# EAGLE design Smart_Powermeter (EAGLE 9.5.1)

## Sheet 1 of 2
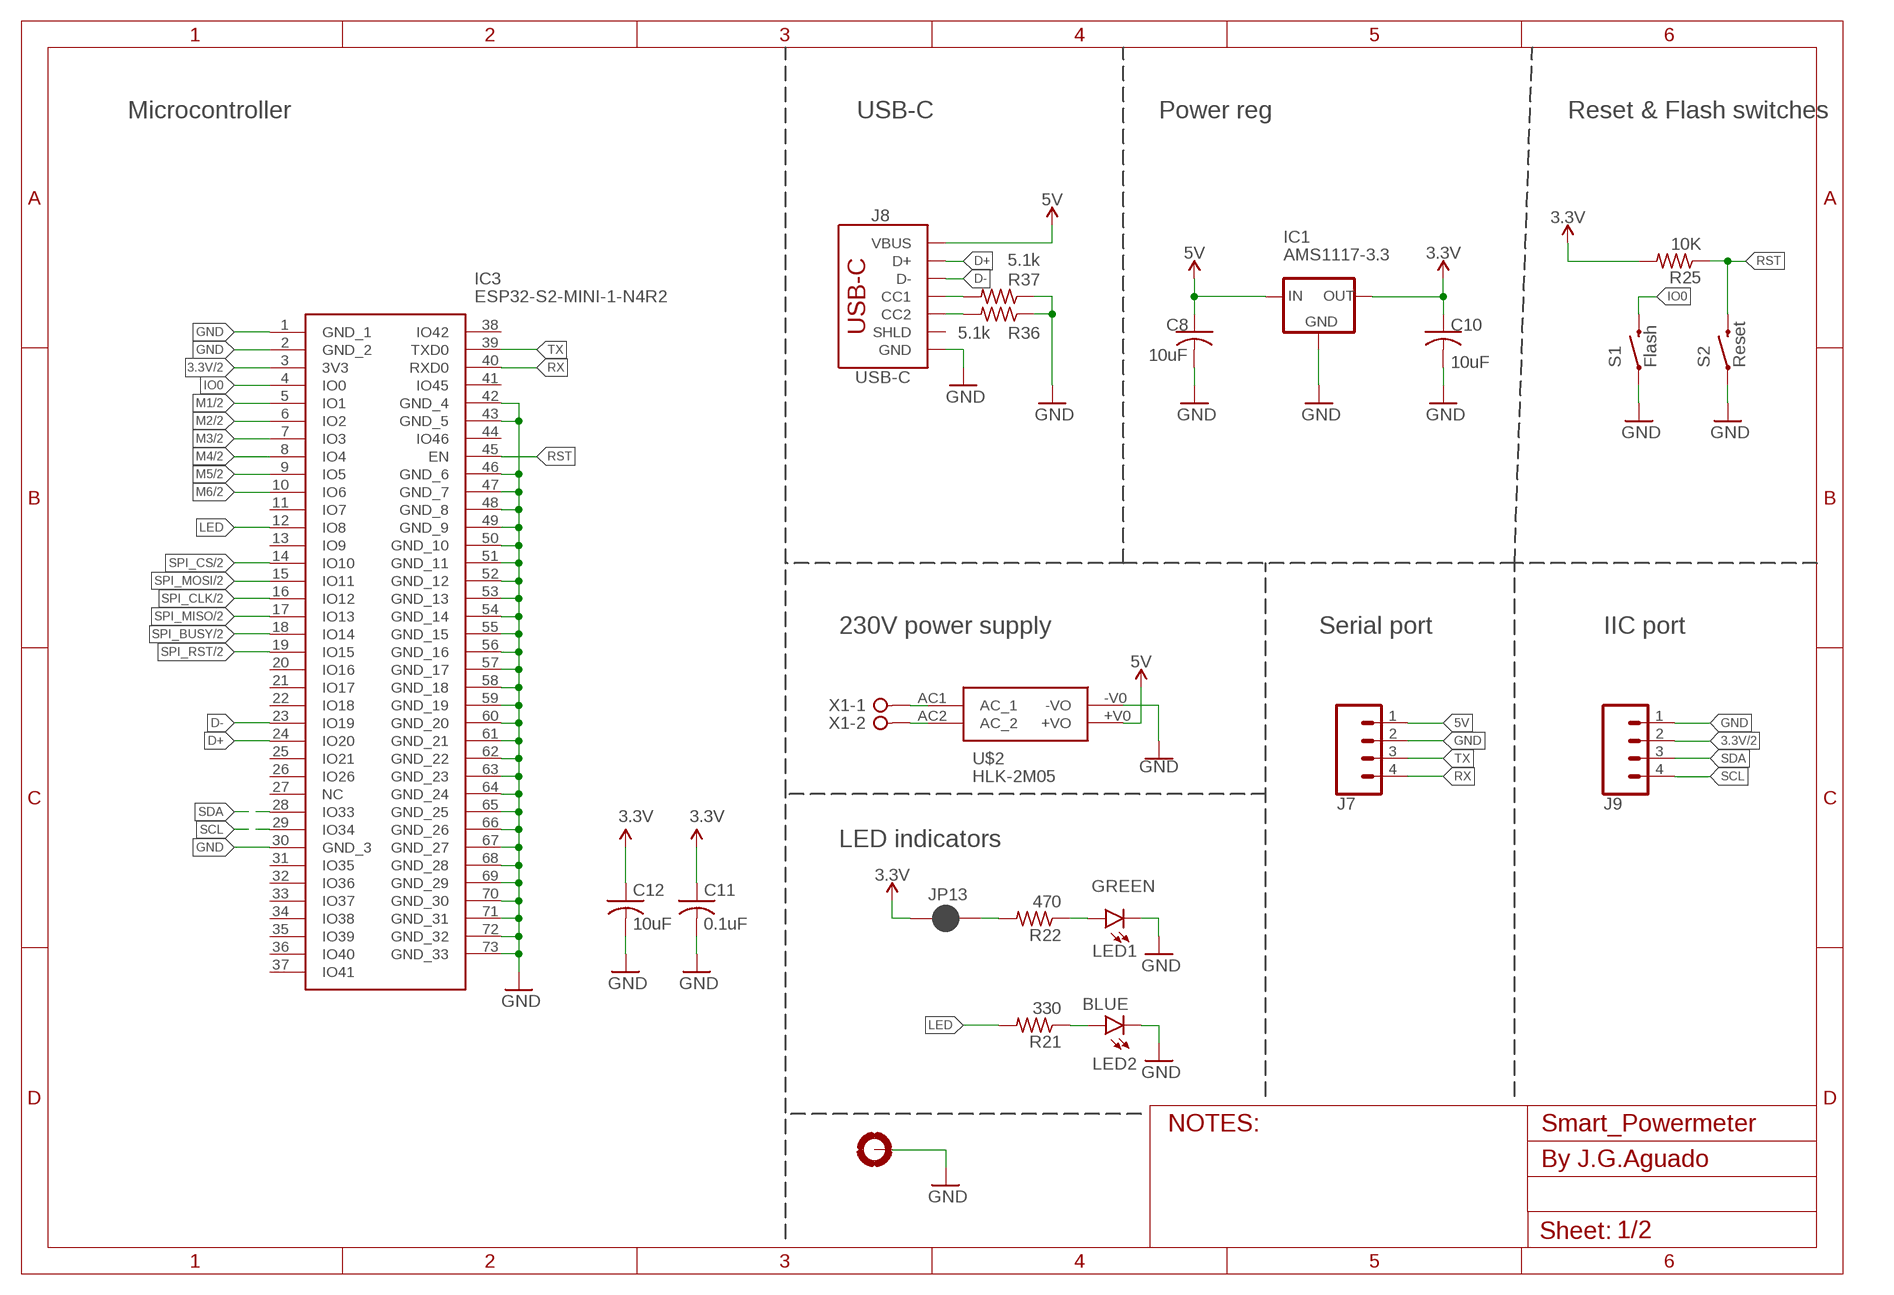
[diagram p0: schematic, sheet 1]

### Parts
C8  10uF  C-USC0603  [C0603]
C10  10uF  C-USC0603  [C0603]
C11  0.1uF  C-USC0603  [C0603]
C12  10uF  C-USC0603  [C0603]
H1  92X84  [92X87]
IC1  AMS1117-3.3  V_REG_LD1117VXXLD1117-SMD  [SOT223]
IC3  ESP32-S2-MINI-1-N4R2  [ESP32S2MINI1N4R2]
J7  CONN_04PTH  [1X04]
J8  USB-C  USB_C_4-LAYER-ISOLATED  [USB-C-16P-4LAYER-ISOLATED]
J9  CONN_04PTH  [1X04]
JP13  JUMPER-SMT_2_NC_PASTE_NO-SILK  [SMT-JUMPER_2_NC_PASTE_NO-SILK]
LED1  GREEN  LED-GREEN0603  [LED-0603]
LED2  BLUE  LED-BLUE0603  [LED-0603]
R21  330  R-US_R0603  [R0603]
R22  470  R-US_R0603  [R0603]
R25  10K  R-US_R0603  [R0603]
R36  5.1k  R-US_R0603  [R0603]
R37  5.1k  R-US_R0603  [R0603]
S1  Flash  MOMENTARY-SWITCH-SPST-SMD-5.2MM-TALL  [TACTILE_SWITCH_SMD_5.2MM]
S2  Reset  MOMENTARY-SWITCH-SPST-SMD-5.2MM-TALL  [TACTILE_SWITCH_SMD_5.2MM]
U$2  HLK-2M05  [HLK-2M05]
X1  W237-02P  [W237-132]

### Nets
3.3V: C10.1 C11.1 C12.1 IC1.2(OUT) IC3.3(3V3) J9.2 JP13.1 R25.2 ; also sheet 2
5V: C8.1 IC1.3(IN) J7.1 J8.VBUS1(VBUS) J8.VBUS2(VBUS) U$2.+V0(+VO)
CC3: J8.B5(CC2) R36.2
CC4: J8.A5(CC1) R37.2
D+: IC3.24(IO20) J8.A6(D+) J8.B6(D+)
D-: IC3.23(IO19) J8.A7(D-) J8.B7(D-)
GND: C8.2 C10.2 C11.2 C12.2 H1.B3,1(MOUNT) H1.B3,2(MOUNT) H1.B3,3(MOUNT) H1.B3,6(MOUNT) H1.P$1(MOUNT) H1.P$2(MOUNT) H1.P$3(MOUNT) H1.P$4(MOUNT) H1.P$5(MOUNT) H1.P$6(MOUNT) H1.P$7(MOUNT) H1.P$8(MOUNT) H1.P$9(MOUNT) H1.P$10(MOUNT) H1.P$11(MOUNT) H1.P$12(MOUNT) H1.P$13(MOUNT) H1.P$14(MOUNT) H1.P$15(MOUNT) H1.P$16(MOUNT) H1.P$17(MOUNT) H1.P$18(MOUNT) H1.P$19(MOUNT) H1.P$20(MOUNT) H1.P$21(MOUNT) H1.P$22(MOUNT) H1.P$23(MOUNT) H1.P$24(MOUNT) H1.P$25(MOUNT) H1.P$26(MOUNT) H1.P$27(MOUNT) H1.P$28(MOUNT) H1.P$29(MOUNT) H1.P$30(MOUNT) H1.P$31(MOUNT) H1.P$32(MOUNT) IC1.1(GND) IC3.1(GND_1) IC3.2(GND_2) IC3.30(GND_3) IC3.42(GND_4) IC3.43(GND_5) IC3.46(GND_6) IC3.47(GND_7) IC3.48(GND_8) IC3.49(GND_9) IC3.50(GND_10) IC3.51(GND_11) IC3.52(GND_12) IC3.53(GND_13) IC3.54(GND_14) IC3.55(GND_15) IC3.56(GND_16) IC3.57(GND_17) IC3.58(GND_18) IC3.59(GND_19) IC3.60(GND_20) IC3.61(GND_21) IC3.62(GND_22) IC3.63(GND_23) IC3.64(GND_24) IC3.65(GND_25) IC3.66(GND_26) IC3.67(GND_27) IC3.68(GND_28) IC3.69(GND_29) IC3.70(GND_30) IC3.71(GND_31) IC3.72(GND_32) IC3.73(GND_33) J7.2 J8.GND J8.GND2(GND) J9.1 LED1.C LED2.C R36.1 R37.1 S1.1 S2.1 U$2.-V0(-VO) ; also sheet 2
IO0: IC3.4(IO0) S1.3
LED: IC3.12(IO8) R21.2
M1: IC3.5(IO1) ; also sheet 2
M2: IC3.6(IO2) ; also sheet 2
M3: IC3.7(IO3) ; also sheet 2
M4: IC3.8(IO4) ; also sheet 2
M5: IC3.9(IO5) ; also sheet 2
M6: IC3.10(IO6) ; also sheet 2
N$1: U$2.AC2(AC_2) X1.2
N$2: U$2.AC1(AC_1) X1.1
N$22: JP13.2 R22.2
N$29: LED2.A R21.1
N$33: LED1.A R22.1
RST: IC3.45(EN) R25.1 S2.3
RX: IC3.40(RXD0) J7.4
SCL: IC3.29(IO34) J9.4
SDA: IC3.28(IO33) J9.3
SPI_BUSY: IC3.18(IO14) ; also sheet 2
SPI_CLK: IC3.16(IO12) ; also sheet 2
SPI_CS: IC3.14(IO10) ; also sheet 2
SPI_MISO: IC3.17(IO13) ; also sheet 2
SPI_MOSI: IC3.15(IO11) ; also sheet 2
SPI_RST: IC3.19(IO15) ; also sheet 2
TX: IC3.39(TXD0) J7.3
Unconnected: IC3.11(IO7) IC3.13(IO9) IC3.20(IO16) IC3.21(IO17) IC3.22(IO18) IC3.25(IO21) IC3.26(IO26) IC3.27(NC) IC3.31(IO35) IC3.32(IO36) IC3.33(IO37) IC3.34(IO38) IC3.35(IO39) IC3.36(IO40) IC3.37(IO41) IC3.38(IO42) IC3.41(IO45) IC3.44(IO46) J8.SHLD1(SHLD) J8.SHLD2(SHLD) J8.SHLD3(SHLD) J8.SHLD4(SHLD) J8.SHLD5(SHLD) J8.SHLD6(SHLD) J8.SHLD7(SHLD) J8.SHLD8(SHLD)

### Notes on the sheet
- Microcontroller | USB-C | Power reg | Reset & Flash switches
- 230V power supply | Serial port | IIC port
- LED indicators

## Sheet 2 of 2
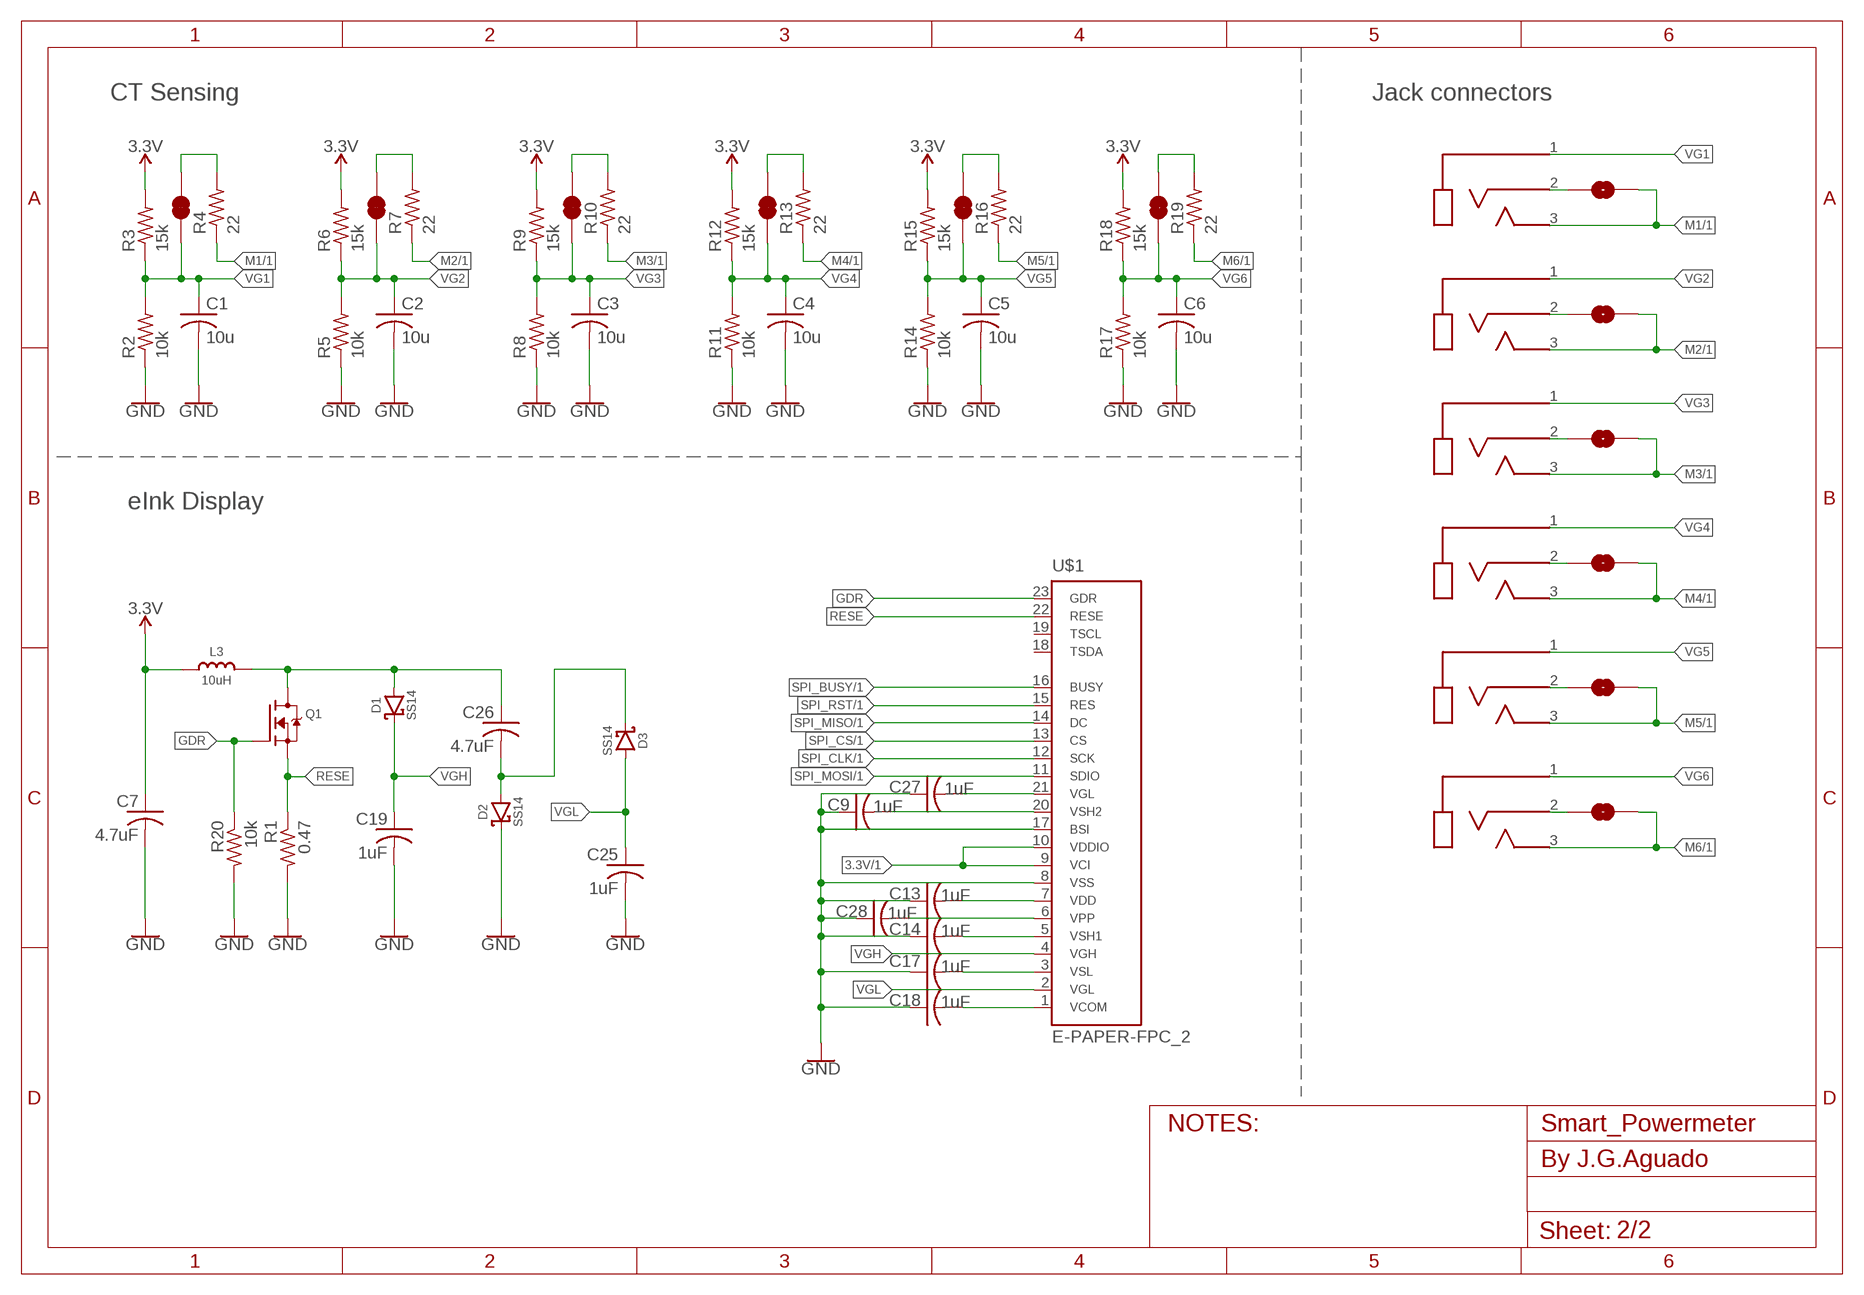
[diagram p1: schematic, sheet 2]

### Parts
C1  10u  C-USC0603  [C0603]
C2  10u  C-USC0603  [C0603]
C3  10u  C-USC0603  [C0603]
C4  10u  C-USC0603  [C0603]
C5  10u  C-USC0603  [C0603]
C6  10u  C-USC0603  [C0603]
C7  4.7uF  C-USC0603  [C0603]
C9  1uF  C-USC0603  [C0603]
C13  1uF  C-USC0603  [C0603]
C14  1uF  C-USC0603  [C0603]
C17  1uF  C-USC0603  [C0603]
C18  1uF  C-USC0603  [C0603]
C19  1uF  C-USC0603  [C0603]
C25  1uF  C-USC0603  [C0603]
C26  4.7uF  C-USC0603  [C0603]
C27  1uF  C-USC0603  [C0603]
C28  1uF  C-USC0603  [C0603]
D1  SS14  DIODE-SCHOTTKYSS14  [SMA-DIODE]
D2  SS14  DIODE-SCHOTTKYSS14  [SMA-DIODE]
D3  SS14  DIODE-SCHOTTKYSS14  [SMA-DIODE]
J1  AUDIO_JACK_MONO_3.5_3P  [HC-PJ-320A-3P-D]
J2  AUDIO_JACK_MONO_3.5_3P  [HC-PJ-320A-3P-D]
J3  AUDIO_JACK_MONO_3.5_3P  [HC-PJ-320A-3P-D]
J4  AUDIO_JACK_MONO_3.5_3P  [HC-PJ-320A-3P-D]
J5  AUDIO_JACK_MONO_3.5_3P  [HC-PJ-320A-3P-D]
J6  AUDIO_JACK_MONO_3.5_3P  [HC-PJ-320A-3P-D]
JP1  JUMPER-SMT_2_NC_TRACE_NO-SILK  [SMT-JUMPER_2_NC_TRACE_NO-SILK]
JP2  JUMPER-SMT_2_NC_TRACE_NO-SILK  [SMT-JUMPER_2_NC_TRACE_NO-SILK]
JP3  JUMPER-SMT_2_NC_TRACE_NO-SILK  [SMT-JUMPER_2_NC_TRACE_NO-SILK]
JP4  JUMPER-SMT_2_NC_TRACE_NO-SILK  [SMT-JUMPER_2_NC_TRACE_NO-SILK]
JP5  JUMPER-SMT_2_NC_TRACE_NO-SILK  [SMT-JUMPER_2_NC_TRACE_NO-SILK]
JP6  JUMPER-SMT_2_NC_TRACE_NO-SILK  [SMT-JUMPER_2_NC_TRACE_NO-SILK]
JP7  JUMPER-SMT_2_NO_NO-SILK  [SMT-JUMPER_2_NO_NO-SILK]
JP8  JUMPER-SMT_2_NO_NO-SILK  [SMT-JUMPER_2_NO_NO-SILK]
JP9  JUMPER-SMT_2_NO_NO-SILK  [SMT-JUMPER_2_NO_NO-SILK]
JP10  JUMPER-SMT_2_NO_NO-SILK  [SMT-JUMPER_2_NO_NO-SILK]
JP11  JUMPER-SMT_2_NO_NO-SILK  [SMT-JUMPER_2_NO_NO-SILK]
JP12  JUMPER-SMT_2_NO_NO-SILK  [SMT-JUMPER_2_NO_NO-SILK]
L3  10uH  INDUCTORNR401  [INDUCTOR_4X4MM_NR401]
Q1  IRLML0100  IRLML2060TRPBF  [SOT23-3]
R1  0.47  R-US_R0603  [R0603]
R2  10k  R-US_R0603  [R0603]
R3  15k  R-US_R0603  [R0603]
R4  22  R-US_R0603  [R0603]
R5  10k  R-US_R0603  [R0603]
R6  15k  R-US_R0603  [R0603]
R7  22  R-US_R0603  [R0603]
R8  10k  R-US_R0603  [R0603]
R9  15k  R-US_R0603  [R0603]
R10  22  R-US_R0603  [R0603]
R11  10k  R-US_R0603  [R0603]
R12  15k  R-US_R0603  [R0603]
R13  22  R-US_R0603  [R0603]
R14  10k  R-US_R0603  [R0603]
R15  15k  R-US_R0603  [R0603]
R16  22  R-US_R0603  [R0603]
R17  10k  R-US_R0603  [R0603]
R18  15k  R-US_R0603  [R0603]
R19  22  R-US_R0603  [R0603]
R20  10k  R-US_R0603  [R0603]
U$1  E-PAPER-FPC_2  [FPC-05FB-24PH20]

### Nets
3.3V: C7.1 L3.P$2 R3.2 R6.2 R9.2 R12.2 R15.2 R18.2 U$1.9 U$1.10 ; also sheet 1
GDR: Q1.1(G) R20.1 U$1.23
GND: C1.2 C2.2 C3.2 C4.2 C5.2 C6.2 C7.2 C9.1 C13.1 C14.1 C17.1 C18.1 C19.2 C25.2 C27.1 C28.1 D2.C R1.2 R2.1 R5.1 R8.1 R11.1 R14.1 R17.1 R20.2 U$1.8 U$1.17 ; also sheet 1
M1: J1.3 JP7.1 R4.1 ; also sheet 1
M2: J2.3 JP8.1 R7.1 ; also sheet 1
M3: J3.3 JP9.1 R10.1 ; also sheet 1
M4: J4.3 JP10.1 R13.1 ; also sheet 1
M5: J5.3 JP11.1 R16.1 ; also sheet 1
M6: J6.3 JP12.1 R19.1 ; also sheet 1
N$3: JP1.2 R4.2
N$4: JP2.2 R7.2
N$5: JP3.2 R10.2
N$6: JP4.2 R13.2
N$7: JP5.2 R16.2
N$8: JP6.2 R19.2
N$9: J1.2 JP7.2
N$10: J2.2 JP8.2
N$11: C9.2 U$1.20
N$12: C13.2 U$1.7
N$13: C14.2 U$1.5
N$14: C17.2 U$1.3
N$15: C18.2 U$1.1
N$16: C26.2 D2.A D3.C
N$17: C26.1 D1.A L3.P$1 Q1.3(D)
N$18: J3.2 JP9.2
N$19: J4.2 JP10.2
N$20: J5.2 JP11.2
N$21: J6.2 JP12.2
N$31: C27.2 U$1.21
N$32: C28.2 U$1.6
RESE: Q1.2(S) R1.1 U$1.22
SPI_BUSY: U$1.16 ; also sheet 1
SPI_CLK: U$1.12 ; also sheet 1
SPI_CS: U$1.13 ; also sheet 1
SPI_MISO: U$1.14 ; also sheet 1
SPI_MOSI: U$1.11 ; also sheet 1
SPI_RST: U$1.15 ; also sheet 1
VG1: C1.1 J1.1 JP1.1 R2.2 R3.1
VG2: C2.1 J2.1 JP2.1 R5.2 R6.1
VG3: C3.1 J3.1 JP3.1 R8.2 R9.1
VG4: C4.1 J4.1 JP4.1 R11.2 R12.1
VG5: C5.1 J5.1 JP5.1 R14.2 R15.1
VG6: C6.1 J6.1 JP6.1 R17.2 R18.1
VGH: C19.1 D1.C U$1.4
VGL: C25.1 D3.A U$1.2
Unconnected: U$1.18 U$1.19

### Notes on the sheet
- CT Sensing | Jack connectors
- eInk Display

## Library data of the parts
C1-C14 C17-C19 C25-C28 = rcl:C-US: CAPACITOR, American symbol; SPICEPREFIX: C
D1-D3 = SpaceDIY_semiconductors:DIODE-SCHOTTKY: Schottky diode A Schottky diode is a semiconductor diode which has a low forward voltage drop and a very fast switching action.; PROD_ID: DIO-08053; VALUE: 1A/40V/500mV
H1 = SpaceDIY_symbols:92X84
IC1 = SparkFun-IC-Power:V_REG_LD1117VXX: LD1117VXX voltage regulator. We carry the 3.3V version (COM-00526) in TO-220 package.; PROD_ID: VREG-13917
IC3 = SpaceDIY_modules:ESP32-S2-MINI-1-N4R2: WiFi Modules - 802.11 SMD module, ESP32-S2FN4R2 with 4 MB flash die and 2 MB PSRAM die inside, PCB antenna Source: Datasheet <https://cz.mouser.com/datasheet/2/891/esp32_s2_mini_1_esp32_s2_mini_1u_datasheet_en-1928084.pdf>; DESCRIPTION: WiFi Modules - 802.11 SMD module, ESP32-S2FN4R2 with 4 MB flash die and 2 MB PSRAM die inside, PCB antenna; HEIGHT: 2.55mm; MANUFACTURER_NAME: Espressif Systems; MANUFACTURER_PART_NUMBER: ESP32-S2-MINI-1-N4R2; MOUSER_PART_NUMBER: 356-ESP32S2MINI1N4R2; MOUSER_PRICE-STOCK: https://www.mouser.co.uk/ProductDetail/Espressif-Systems/ESP32-S2-MINI-1-N4R2?qs=iLbezkQI%252Bsgb61FCBnw%252B9A%3D%3D
J1-J6 = SpaceDIY_connectors:AUDIO_JACK_MONO_3.5_3P; LCSC: C5372850
J7 J9 = SparkFun-Connectors:CONN_04: Multi connection point. Often used as Generic Header-pin footprint for 0.1 inch spaced/style header connections On any of the 0.1 inch spaced packages, you can populate with these: Break Away Headers - Straight <https://www.sparkfun.com/products/116> (PRT-00116) Break Away Male Headers - Right Angle <https://www.sparkfun.com/products/553> (PRT-00553) Female Headers <https://www.sparkfun.com/products/115> (PRT-00115) Break Away Headers - Machine Pin <https://www.sparkfun.com/products/117> (PRT-00117) Break Away Female Headers - Swiss Machine Pin <https://www.sparkfun.com/products/743> (PRT-00743) For SCREWTERMINALS and SPRING TERMINALS visit here: Screw Terimnals on SparkFun.com <https://www.sparkfun.com/search/results?term=Screw+Terminals> (5mm/3.5mm/2.54mm spacing) This device is also useful as a general connection point to wire up your design to another part of your project. Our various solder wires solder well into these plated through hole pads. Hook-Up Wire - Assortment (Stranded, 22 AWG) <https://www.sparkfun.com/products/11375> (PRT-11375) Hook-Up Wire - Assortment (Solid Core, 22 AWG) <https://www.sparkfun.com/products/11367> (PRT-11367) View the entire wire category on our website here <https://www.sparkfun.com/categories/141> Special notes: Molex polarized connector foot print use with SKU : PRT-08231 with associated crimp pins and housings. 1MM SMD Version SKU: PRT-10208; PROD_ID: CONN-09696
J8 = SparkFun-Connectors:USB_C: USB Type C 16Pin Connector Super Speed pins not available on the 16-pin purely SMD connector so this part is best for USB 2.0 implementations. D1 and D2 are tied together enabling D+/- no matter which way the cable is plugged into the connector. The two channel configuration pins (CC1/2) are exposed. These are normally connected to ground via 5.1k resistors but can be reconfigured for high current/high power applications. **4-LAYER BOARD WARNING!!** If designing 4-layer board, make sure to select the variant _4-LAYER-ISOLATED. The linked footprint (USB-C-16-4LAYER-ISOLATED) includes some very necessary cutout polygons in the inner layers (2 and 15). This prevents the PTH mounting shield legs on the USB connector from electrically connecting any other polygons on the inner layers (usually VCC and GND).; PROD_ID: CONN-14122; VALUE: USB Female Type C Connector
JP1-JP6 = SparkFun-Jumpers:JUMPER-SMT_2_NC_TRACE: Normally closed trace jumper This jumper has a trace between two pads so it's normally closed (NC). Use a razor knife to open the connection. For best results follow the IPC guidelines for cutting traces: Cutout at least 0.063 mm (0.005 in). Remove all loose material to clean up the cut area. Seal the cut with an approved epoxy. Reapply solder to reclose the connection.
JP7-JP12 = SparkFun-Jumpers:JUMPER-SMT_2_NO: Normally open jumper This jumper has two pads in close proximity to each other. Apply solder to close the connection. Round pads are easier to solder for beginners, but are a lot larger. SparkFun Product that uses the round pads: SparkFun EL Sequencer <https://www.sparkfun.com/products/12781>
JP13 = SparkFun-Jumpers:JUMPER-SMT_2_NC_PASTE: Normally closed solder jumper This jumper has an aperture in the stencil to allow solder paste to bridge the split in the wire so it's normally closed (NC). Wick off the solder to open the connection. Reapply solder to reclose the connection.
L3 = microbuilder:INDUCTOR: Inductors 0603: 10nH Ceramic Inductor - microwire antenna/RF (Digikey: 712-1434-2-ND) 0805: 560nH Ceramic Inductor - RF (Digikey: 553-1047-1-ND) 270nH Ceramic Inductor - Q = 40@250MHz, +-5%, 1 Ohm DC Resistance (Digikey: 535-10506-2-ND) 1007 (2518 Metric) SMT: 10µH 10% 250mOhm 820mA 1007 Inductor (Digikey: 587-2189-1-ND) 22µH 10% 500mOhm 580mA 1007 Inductor (Digikey: 587-2190-1-ND) 47µH 10% 950mOhm 420mA 1007 Inductor (Digikey: 587-2191-1-ND) 47µH 5% 100mOhm 1A 1008 Inductor (Digikey: 732-1816-1-ND) 5.0x5.0mm (Taiyo Yuden NR5040 Series) 6.8µH 20% 2.3A 64mOhm Inductor (Digikey: 587-2374-2-ND) 5.0x5.0mm (TDK VLC5045 Series) 4.7µH 20% 3.3A 34mOhm Inductor (Digikey: 445-6526-1-ND) 6.8µH 20% 2.7A 46mOhm Inductor (Digikey: 445-6527-1-ND) 6.0x6.0mm (TDK VLC6045 Series) 4.7µH 20% 3.8A 27mOhm Inductor (Digikey: 445-6538-2-ND) 6.8µH 20% 3A 41mOhm Inductor (Digikey: 445-6540-1-ND) 6.2µH 30% 2.2A 45mOhm Inductor (Digikey: SRR5028-6R2YCT-ND) - Not TDK VLC6045 but footprint should match 6.0x6.0mm (TDK SLF6045 Series) 6.8uH 30% 2A 33mOhm Inductor (Digikey: 445-4572-1-ND, Mouser: 810-SLF645T6R8N2R0PF) 6.0x6.0mm (Sumida CDRH5D28 Series) 6.2uH 30% 1.8A 45mOhm Inductor (Digikey: 308-1542-1-ND) Taiyo Yuden NR3015T2R2M - 2.2uH 20% 1.5A (Digikey: 587-1648-2-ND, Mouser: 963-NR3015T2R2M) - Used with TI TPS62172 CoilCraft RFID Transponder Coil - MA5532-AE (For use with AS3935 Lightning Sensor) Taiyo Yuden NRH2412T2R2MNGH - 2.2uH 20% 1AA (Digikey: 587-3443-1-ND) - Used with TI LM3671 Vishay IHLP 1.0uH Molded Inductor - 24mOhm DCR, 5A, +/-20%, -55°C-125°C (Digikey: 541-1319-1-ND)
LED1 = SparkFun-LED:LED-GREEN: Green SMD LED Used in manufacturing of various products at SparkFun Packages: 0603 - SMD 0603 package [Product Link] <http://www.futureelectronics.com/en/technologies/semiconductors/optoelectronics/leds/Pages/9894312-LTST-C190GKT.aspx?CrossPart=HSMG-C190&IM=0> LilyPad 1206 - SMD1206 LilyPad package [Product Link] <http://www.futureelectronics.com/en/Technologies/Product.aspx?ProductID=IN150NGHARVATEKCORPORATION2049943&IM=0> 1206 - SMD1206 package [Product Link] <http://www.futureelectronics.com/en/technologies/semiconductors/optoelectronics/leds/Pages/8315665-LTST-C150KGKT.aspx?IM=0> 1206 Bottom Mount -SMD 1206 Bottom Mount [Product Link] <http://www.digikey.com/product-detail/en/lite-on-inc/LTST-C230KGKT/160-1456-1-ND/386854> SparkFun Products: Pro Mini 328 -5V <https://www.sparkfun.com/products/821> RedBoard <https://www.sparkfun.com/products/12757> MP3 Trigger <https://www.sparkfun.com/products/13720> Makey Makey <https://www.sparkfun.com/products/11076>; LCSC: C72043; PROD_ID: DIO-00821
LED2 = SparkFun-LED:LED-BLUE: Blue SMD LED Used in manufacturing of various products at SparkFun Packages: 0603 - SMD 0603 package [Product Link] <http://www.digikey.com/product-detail/en/SMLE12BC7TT86/511-1589-2-ND/1641808> 1206 - SMD1206 package [Product Link] <http://www.digikey.com/product-detail/en/lite-on-inc/LTST-C150TBKT/160-1643-1-ND/573584> SparkFun Products: ESP8266 Thing-Dev Board <https://www.sparkfun.com/products/13711> RedBoard <https://www.sparkfun.com/products/12757>; PROD_ID: DIO-08575
Q1 = Parts:IRLML2060TRPBF
R1-R22 R25 R36 R37 = rcl:R-US_: RESISTOR, American symbol; SPICEPREFIX: R
S1 S2 = SpaceDIY_electromechanical:MOMENTARY-SWITCH-SPST: Momentary Switch (Pushbutton) - SPST Normally-open (NO) SPST momentary switches (buttons, pushbuttons). Variants PTH-12MM - 12mm square, through-hole Momentary Pushbutton Switch - 12mm Square <https://www.sparkfun.com/products/9190> (COM-09190) PTH-6.0MM, PTH-6.0MM-KIT - 6.0mm square, through-hole Mini Pushbutton Switch <https://www.sparkfun.com/products/97> (COM-00097) KIT package intended for soldering kit's - only one side of pads' copper is exposed. PTH-RIGHT-ANGLE-KIT - Right-angle, through-hole Right Angle Tactile Button <https://www.sparkfun.com/products/10791> - Used on SparkFun BigTime Watch Kit <https://www.sparkfun.com/products/11734> SMD-12MM - 12mm square, surface-mount Tactile Button - SMD (12mm) <https://www.sparkfun.com/products/12993> (COM-12993) Used on SparkFun PicoBoard <https://www.sparkfun.com/products/11888> SMD-4.5MM - 4.5mm Square Trackball Switch Used on SparkFun Blackberry Trackballer Breakout <https://www.sparkfun.com/products/13169> SMD-4.6MMX2.8MM - 4.60mm x 2.80mm, surface mount Used on SparkFun Pro Micro - RP2040 <https://www.sparkfun.com/products/17717> SMD-5.2MM, SMD-5.2-REDUNDANT - 5.2mm square, surface-mount Mini Pushbutton Switch - SMD <https://www.sparkfun.com/products/8720> (COM-08720) Used on Arduino Pro Mini <https://www.sparkfun.com/products/11114> REDUNDANT package connects both switch circuits together SMD-6.0X3.5MM - 6.0 x 3.5mm, surface mount Momentary Reset Switch SMD <https://www.sparkfun.com/products/8229> (COM-08229) SMD-6.2MM-TALL - 6.2mm square, surface mount Tactile Button - SMD (6mm) <https://www.sparkfun.com/products/12992> Used on SparkFun Digital Sandbox <https://www.sparkfun.com/products/12651> SMD-RIGHT-ANGLE - Right-angle, surface mount Used on SparkFun Block for Intel® Edison - Arduino <https://www.sparkfun.com/products/13036>; LCSC: C318884; PROD_ID: SWCH-14139
U$1 = SpaceDIY_connectors:E-PAPER-FPC_2: This version if for the epaper on the same side of the pcb as the connector; LCSC: C2856831
U$2 = SpaceDIY_modules:HLK-2M05: HLK-2M05 Power Supply
X1 = con-wago-508:W237-02P: WAGO SREW CLAMP; OC_FARNELL: unknown; OC_NEWARK: unknown

## Net classes
0 default: clearance 0.205 mm
1 power: width 0.254 mm
2 analog: width 0.203 mm, drill 0.33 mm, clearance 0.152 mm

## Board
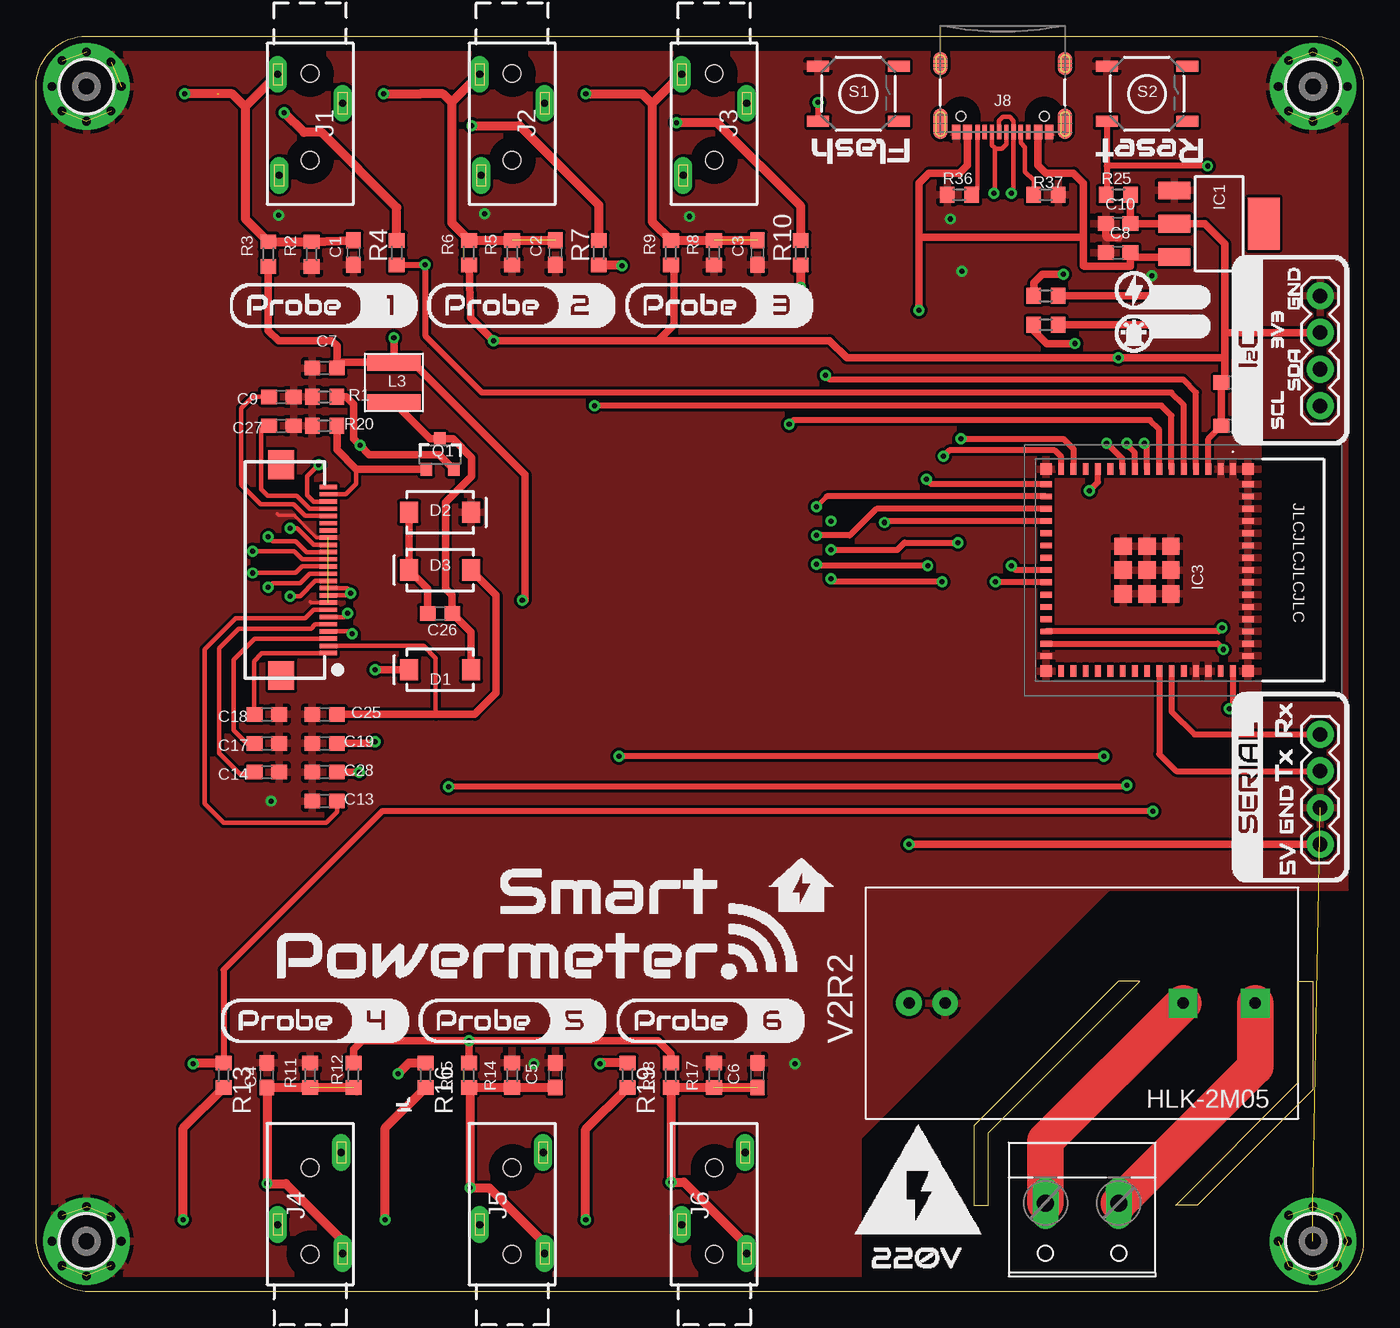
[diagram p2: board, top side]
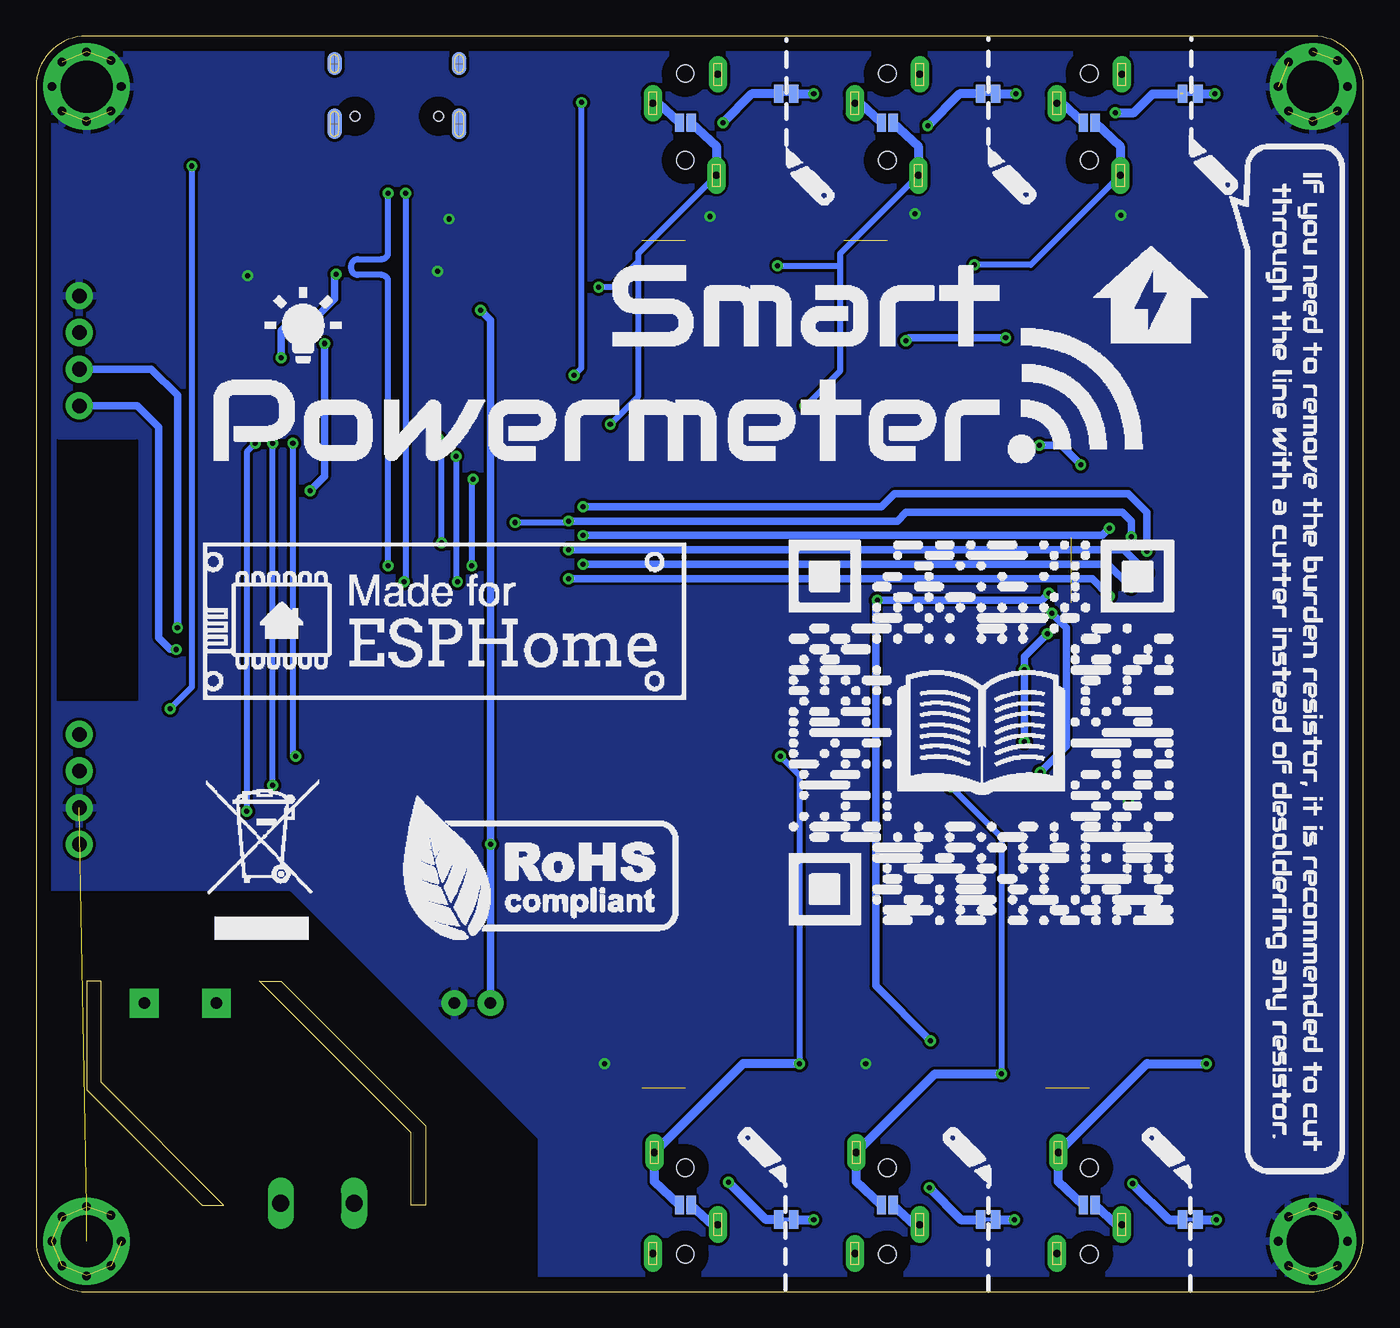
[diagram p3: board, bottom side, seen from below]

Size 92 x 87 mm. Coordinates in mm from the lower left corner, seen from the top.
Outline: 66,6 66,11 76.5,21.5 75,21.5 65,11.5 65,6 66,6
Outline: 79,6 87.5,14.5 87.5,21.5 88.5,21.5 88.5,14 80.5,6 79,6
Copper layers (1*16): Top 0.035mm / dielectric 1.5mm / Bottom 0.035mm
Design rules "default": minimum track width 6mil, minimum drill 0.35mm, track to track 6mil, track to pad 6mil, pad to pad 6mil, via to via 6mil, smd to smd 6mil, copper to edge 40mil, drill to drill 6mil, minimum pad ring 10mil, minimum via ring 8mil, stop-mask expansion 4mil, vias tented up to drill 0mil, thermal gap 10mil
tRestrict: area 57.5,0.5 to 92,27.5
bRestrict: area 57.5,0.5 to 92,27.5

### Footprints (pad centres in the part's own frame; a part is rotated, then mirrored left to right if it is on the bottom)
C0603 = smd 1.1 x 1: 1 -0.85,0; 2 0.85,0
SMA-DIODE = smd 1.27 x 1.47: A -2.15,0; C 2.15,0
92X87 = drill 3.6 pad 6: B3,1 3.5,83.5; B3,2 88.5,83.5; B3,3 88.5,3.5; B3,6 3.5,3.5 | drill 0.6 pad 0.61: P$1 3.5,5.9; P$2 1.1,3.5; P$3 3.5,1.1; P$4 5.9,3.5; P$5 1.8,5.3; P$6 5.2,5.2; P$7 5.2,1.8; P$8 1.8,1.8; P$9 3.5,85.9; P$10 1.1,83.5; P$11 3.5,81.1; P$12 5.9,83.5; P$13 1.8,85.3; P$14 5.2,85.2; P$15 5.2,81.8; P$16 1.8,81.8; P$17 88.5,85.9; P$18 86.1,83.5; P$19 88.5,81.1; P$20 90.9,83.5; P$21 86.8,85.3; P$22 90.2,85.2; P$23 90.2,81.8; P$24 86.8,81.8; P$25 88.5,5.9; P$26 86.1,3.5; P$27 88.5,1.1; P$28 90.9,3.5; P$29 86.8,5.3; P$30 90.2,5.2; P$31 90.2,1.8; P$32 86.8,1.8
SOT223 = smd 1.219 x 2.235: 1 -2.311,-3.099; 2 0,-3.099; 3 2.311,-3.099 | smd 3.6 x 2.2: 4 0,3.099
ESP32S2MINI1N4R2 = smd 0.8 x 0.4: 1 -7,5.95; 2 -7,5.1; 3 -7,4.25; 4 -7,3.4; 5 -7,2.55; 6 -7,1.7; 7 -7,0.85; 8 -7,0; 9 -7,-0.85; 10 -7,-1.7; 11 -7,-2.55; 12 -7,-3.4; 13 -7,-4.25; 14 -7,-5.1; 15 -7,-5.95; 31 7,-5.95; 32 7,-5.1; 33 7,-4.25; 34 7,-3.4; 35 7,-2.55; 36 7,-1.7; 37 7,-0.85; 38 7,0; 39 7,0.85; 40 7,1.7; 41 7,2.55; 42 7,3.4; 43 7,4.25; 44 7,5.1; 45 7,5.95 | smd 0.4 x 0.8: 16 -5.95,-7; 17 -5.1,-7; 18 -4.25,-7; 19 -3.4,-7; 20 -2.55,-7; 21 -1.7,-7; 22 -0.85,-7; 23 0,-7; 24 0.85,-7; 25 1.7,-7; 26 2.55,-7; 27 3.4,-7; 28 4.25,-7; 29 5.1,-7; 30 5.95,-7; 46 5.95,7; 47 5.1,7; 48 4.25,7; 49 3.4,7; 50 2.55,7; 51 1.7,7; 52 0.85,7; 53 0,7; 54 -0.85,7; 55 -1.7,7; 56 -2.55,7; 57 -3.4,7; 58 -4.25,7; 59 -5.1,7; 60 -5.95,7 | smd 1.2 x 1.2: 61 0,0; 66 -1.65,1.65; 67 -1.65,0; 68 -1.65,-1.65; 69 0,-1.65; 70 1.65,-1.65; 71 1.65,0; 72 1.65,1.65; 73 0,1.65 | smd 0.8 x 0.8: 62 -7,7; 63 -7,-7; 64 7,-7; 65 7,7
HC-PJ-320A-3P-D = drill 0.5 pad 1.27 long: 1 2.25,2.15; 2 -2.25,4.15; 3 2.15,9.15 | hole 1.2: 0,2.1; 0,8.1
1X04 = drill 1.016 pad 1.88: 1 0,0; 2 2.54,0; 3 5.08,0; 4 7.62,0
USB-C-16P-4LAYER-ISOLATED = smd 0.3 x 1: A5 -1.25,-0.34; A6 -0.25,-0.34; A7 0.25,-0.34; A8 1.25,-0.34; B5 1.75,-0.34; B6 0.75,-0.34; B7 -0.75,-0.34; B8 -1.75,-0.34 | smd 0.6 x 1: GND -3.225,-0.34; GND2 3.225,-0.34; VBUS1 -2.45,-0.34; VBUS2 2.45,-0.34 | smd 1 x 2.1: SHLD1 -4.32,-0.915; SHLD2 4.32,-0.915 | smd 1 x 2.1 bottom: SHLD3 -4.32,-0.915; SHLD4 4.32,-0.915 | smd 1 x 1.6: SHLD5 -4.32,-5.095; SHLD8 4.32,-5.095 | smd 1 x 1.6 bottom: SHLD6 -4.32,-5.095; SHLD7 4.32,-5.095 | hole 0.65: -2.89,-1.445; 2.89,-1.445
SMT-JUMPER_2_NC_TRACE_NO-SILK = smd 0.66 x 1.27: 1 -0.521,0; 2 0.521,0
SMT-JUMPER_2_NO_NO-SILK = smd 0.635 x 1.27: 1 -0.406,0; 2 0.406,0
SMT-JUMPER_2_NC_PASTE_NO-SILK = smd 0.635 x 1.27: 1 -0.406,0; 2 0.406,0
INDUCTOR_4X4MM_NR401 = smd 1.2 x 3.7: P$1 -1.4,0; P$2 1.4,0
LED-0603 = smd 1 x 1: A -0.877,0; C 0.877,0
SOT23-3 = smd 0.8 x 0.9: 1 -0.95,-1; 2 0.95,-1; 3 0,1.1
R0603 = smd 1 x 1.1: 1 -0.85,0; 2 0.85,0
TACTILE_SWITCH_SMD_5.2MM = smd 1.524 x 0.762: 1 -2.794,1.905; 2 2.794,1.905; 3 -2.794,-1.905; 4 2.794,-1.905
FPC-05FB-24PH20 = smd 0.3 x 1.2: 1 5.75,3.25; 2 5.25,3.25; 3 4.75,3.25; 4 4.25,3.25; 5 3.75,3.25; 6 3.25,3.25; 7 2.75,3.25; 8 2.25,3.25; 9 1.75,3.25; 10 1.25,3.25; 11 0.75,3.25; 12 0.25,3.25; 13 -0.25,3.25; 14 -0.75,3.25; 15 -1.25,3.25; 16 -1.75,3.25; 17 -2.25,3.25; 18 -2.75,3.25; 19 -3.25,3.25; 20 -3.75,3.25; 21 -4.25,3.25; 22 -4.75,3.25; 23 -5.25,3.25; 24 -5.75,3.25 | smd 2 x 1.8: P$25 -7.3,0; P$26 7.3,0
HLK-2M05 = drill 0.8 pad 1.778: +V0 27,8; -V0 24.5,8 | drill 0.8 pad 2 square: AC1 3,8; AC2 8,8
W237-132 = drill 1.194 long: 1 -2.54,-0.635; 2 2.54,-0.635

### Placement (x,y rotation side)
C1  22,72 270 top
C2  36,72 270 top
C3  50,72 270 top
C4  16,15 90 top
C5  36,15 90 top
C6  50,15 90 top
C7  20,64 180 top
C8  75,72 180 top
C9  17,62 180 top
C10  75,74 180 top
C11  83,60 0 top
C12  83,63 0 top
C13  20,34 0 top
C14  16,36 180 top
C17  16,38 180 top
C18  16,40 180 top
C19  20,38 180 top
C25  20,40 180 top
C26  28,47 180 top
C27  17,60 180 top
C28  20,36 0 top
D1  28,43.1 180 top
D2  28,54 0 top
D3  28,50 180 top
H1  0,0 0 top
IC1  82,74 270 top
IC3  77,50 270 top
J1  19,86.5 180 top
J2  33,86.5 180 top
J3  47,86.5 180 top
J4  19,0.5 0 top
J5  33,0.5 0 top
J6  47,0.5 0 top
J7  89,31 90 top
J8  67,80 180 top
J9  89,69 270 top
JP1  12,83 180 bottom
JP2  26,83 180 bottom
JP3  40,83 180 bottom
JP4  12,5 0 bottom
JP5  26,5 0 bottom
JP6  40,5 0 bottom
JP7  19,81 180 bottom
JP8  33,81 180 bottom
JP9  47,81 180 bottom
JP10  19,6 0 bottom
JP11  33,6 0 bottom
JP12  47,6 0 bottom
JP13  73.5,67 0 bottom
L3  24.8,63 90 top
LED1  79.5,69 0 top
LED2  79.5,67 0 top
Q1  28,58 0 top
R1  20,62 180 top
R2  19.1,71.9 90 top
R3  16.1,71.9 270 top
R4  25,72 90 top
R5  33,72 90 top
R6  30,72 270 top
R7  39,72 90 top
R8  47,72 90 top
R9  44,72 270 top
R10  53,72 90 top
R11  19,15 270 top
R12  22,15 90 top
R13  13,15 270 top
R14  33,15 270 top
R15  30,15 90 top
R16  27,15 270 top
R17  47,15 270 top
R18  44,15 90 top
R19  41,15 270 top
R20  20,60 180 top
R21  70,67 180 top
R22  70,69 180 top
R25  75,76 0 top
R36  64,76 0 top
R37  70,76 180 top
S1  57,83 0 top
S2  77,83 0 top
U$1  17,50 270 top
U$2  87.5,28 180 top
X1  72.5,5.5 180 top

### Tracks (layer width: path | path; a pad name or v marks a point on that pad's centre or on a via)
3.3V  (via drill 0.35)
  Top 0.305: U$1.9 21.65,48.25 v21.8,48.4 21.8,48.5 21.55,48.75 U$1.10
  Top 0.406: IC3.3 81.25,59.1 C11.1
  Top 0.508: 82.4,66.4 82.4,64.7 | 82.4,64.7 82.4,63.25 C12.1 C11.1 | R6.2 30.1,67.5 v31.7,65.9 43.1,65.9 | 43.1,65.9 44.2,67 44.2,70.95 R9.2 | R3.2 16.1,66.6 16.8,65.9 20.5,65.9 20.85,65.55 C7.1 21.25,64.4 L3.P$2 24.8,64.5 | 24.8,64.5 v24.8,66.1 | R18.2 44,16.5 43.1,17.4 v30,17.4 29.8,17.4 | 29.8,17.4 22.6,17.4 22,16.8 R12.2 | R15.2 30,17.2 29.8,17.4 | v33.7,47.9 33.9,47.9 33.9,56.6 26,64.5 24.8,64.5 | R25.2 C10.1 IC1.2 81,74 82.4,72.6 82.4,66.4 | 43.1,65.9 55,65.9 56.2,64.7 v75,64.7 82.4,64.7 | J9.2 82.46,66.46 82.4,66.4
  Bottom 0.508: v21.8,48.4 22.3,47.9 v33.7,47.9 33.8,47.9 33.8,21.2 v30,17.4 | v24.8,66.1 31.5,66.1 v31.7,65.9 | JP13.1 74.61,67 75.01,66.6 v75,64.7
5V  (via drill 0.35)
  Top 0.508: IC1.3 76.16,71.69 C8.1 75.85,71.05 74.9,71.05 74.89,71.04 72.66,71.04 72.6,71.1 72.6,73.07 | J7.1 v60.5,31 | J8.VBUS2 64.55,78.05 64,77.5 61.9,77.5 61.2,76.8 61.2,73.07 | 61.2,73.07 v61.2,68 | J8.VBUS1 69.45,78.05 70,77.5 71.9,77.5 72.6,76.8 72.6,73.07 | 72.6,73.07 61.2,73.07
  Bottom 0.508: U$2.+V0 v60.5,31 60.5,67.3 v61.2,68
CC3
  Top 0.305: J8.B5 65.25,76.4 R36.2
CC4
  Top 0.305: J8.A5 68.25,79.6 68.55,79.3 68.55,77.6 69.15,77 R37.2
D+  (via drill 0.35)
  Top 0.305: J8.B6 66.25,79.45 66.45,79.25 66.45,79.2 | 66.45,79.2 66.95,79.2 67.25,79.5 J8.A6 | 66.45,79.2 66.45,76.15 v66.4,76.1
  Top 0.406: IC3.24 66.55,49.15 v66.5,49.2
  Bottom 0.406: v66.4,76.1 66.4,49.3 v66.5,49.2
D-  (via drill 0.35)
  Top 0.305: J8.A7 66.75,81.15 67,81.4 67.5,81.4 67.75,81.15 J8.B7 67.75,76.25 v67.6,76.1
  Top 0.406: IC3.23 67.9,50 v67.6,50.3
  Bottom 0.406: v67.6,50.3 67.6,69.99 arc-90 68.06,70.45 69.69,70.45 arc90 70.15,70.91 70.15,71.08 arc90 69.69,71.54 68.06,71.54 arc-90 67.6,72 v67.6,76.1
GDR
  Top 0.305: U$1.23 21.45,55.25 22.2,56 22.2,57
  Top 0.508: R20.1 20.85,58.35 22.2,57 Q1.1
GND  (via drill 0.35)  (22 unrouted)
  Top 0.254: U$1.17 19.43,52.25 17.89,53.8 16.8,53.8 16.7,53.9 | U$1.8 19.05,47.75 19,47.8
  Top 0.508: C10.2 74.15,73.12 74.24,73.04 75.04,73.04
  other vias: 77.33,70.4 64.18,70.71 34.5,15.8 52.6,15.8 16.3,34 45.3,74.5 31.1,74.7 16.8,74.6 63.38,74.33
  pour Top: 3,87 arc90 0,84 0,1.86 arc90 2.92,0 90.05,0.05 arc90 92,2 92,84.5 arc90 89.5,87
  pour Bottom: 3,87 arc90 0,84 0,2.5 arc90 2.5,0 89.5,0 arc90 92,2.5 92,84.5 arc90 89.5,87
IO0  (via drill 0.35)
  Top 0.406: IC3.4 80.4,62.3 79.5,63.2 55,63.2 v54.7,63.5 | v54.2,82.4 S1.3
  Bottom 0.406: v54.7,63.5 54.2,64 v54.2,82.4
LED  (via drill 0.35)
  Top 0.406: v73,55.5 73.6,56.1 IC3.12
  Top 0.508: v72,65.7 70.05,65.7 69.15,66.6 R21.2
  Bottom 0.508: v72,65.7 72,56.5 v73,55.5
M1  (via drill 0.35)
  Top 0.406: IC3.5 79.55,61.45 78.7,62.3 30.9,62.3 27,66.2 27,71.1 v26.95,71.15 R4.1
  Bottom 0.406: J1.3 23.05,71.15 v26.95,71.15
  Bottom 0.61: JP7.1 16.85,79.37 J1.3
M2  (via drill 0.35)
  Top 0.406: IC3.6 78.7,60.7 78,61.4 v38.7,61.4
  Top 0.61: R7.1 40.55,71.15 v40.6,71.1
  Bottom 0.406: v38.7,61.4 38.65,61.4 36.25,63.8 36.25,71.2 | 36.25,71.2 36.25,71.95 J2.3 | v40.6,71.1 36.35,71.1 36.25,71.2
  Bottom 0.61: JP8.1 30.85,79.37 J2.3
M3  (via drill 0.35)
  Top 0.406: IC3.7 77.85,59.75 77.2,60.4 52.5,60.4 v52.2,60.1
  Top 0.61: v53,69.6 R10.1
  Bottom 0.406: v52.2,60.1 50.25,62.05 50.25,71.4 | 50.25,71.4 50.25,71.95 J3.3 | 50.25,71.4 52.05,69.6 v53,69.6
  Bottom 0.61: JP9.1 44.85,79.37 J3.3
M4  (via drill 0.35)
  Top 0.406: IC3.8 77,58.6 v76.8,58.8 | v77.4,33.3 24,33.3 13,22.3 R13.1
  Top 0.61: v10.9,15.8 10.95,15.85 R13.1
  Bottom 0.406: v76.8,58.8 77.4,58.2 v77.4,33.3
  Bottom 0.61: v10.9,15.8 15,15.8 J4.3 21.15,7.63 JP10.1
M5  (via drill 0.35)
  Top 0.406: IC3.9 76.15,58.15 75.6,58.7 v75.6,58.8 | v75.6,35.1 75.5,35 v28.6,35
  Top 0.61: v25.1,15.1 25.85,15.85 R16.1
  Bottom 0.406: v28.6,35 25.1,31.5 v25.1,15.1 | v75.6,35.1 v75.6,58.8
  Bottom 0.61: v25.1,15.1 29.7,15.1 J5.3 35.15,7.63 JP11.1
M6  (via drill 0.35)
  Top 0.406: IC3.10 75.3,57.7 v74.2,58.8 | v74,37.1 v40.4,37.1
  Top 0.61: R19.1 39.15,15.85 v39.1,15.8
  Bottom 0.406: v74.2,58.8 74.2,37.1 v74,37.1 | v40.4,37.1 39.1,35.8 v39.1,15.8
  Bottom 0.61: v39.1,15.8 43,15.8 J6.3 49.15,7.63 JP12.1
N$1
  Top 2.54: U$2.AC2 69.96,10.46 X1.2
N$2
  Top 2.54: X1.1 84.5,15.6 U$2.AC1
N$3  (via drill 0.35)  (1 unrouted)
  Top 0.61: v17.2,81.7 18.58,80.32 19.8,80.32 25,75.12 R4.2
  Bottom 0.61: v17.2,81.7 15.9,81.7 14.6,83 12.7,83
N$4  (via drill 0.35)
  Top 0.61: v30.2,80.8 33.5,80.8 39,75.3 R7.2
  Bottom 0.61: JP2.2 28,83 v30.2,80.8
N$5  (via drill 0.35)
  Top 0.61: R10.2 53,75.2 47.2,81 v44.4,81
  Bottom 0.406: JP3.2 40.7,83
  Bottom 0.61: v44.4,81 42.4,83 40.7,83
N$6  (via drill 0.35)
  Top 0.61: v10.2,5 10.2,11.35 R13.2
  Bottom 0.61: JP4.2 v10.2,5
N$7  (via drill 0.35)
  Top 0.61: v24.2,5 24.2,11.35 R16.2
  Bottom 0.61: JP5.2 v24.2,5
N$8  (via drill 0.35)
  Top 0.61: v38.1,5 38.1,11.25 R19.2
  Bottom 0.61: JP6.2 v38.1,5
N$9
  Bottom 0.61: JP7.2 20.87,82.35 J1.2
N$10
  Bottom 0.61: JP8.2 34.87,82.35 J2.2
N$11
  Top 0.305: C9.2 15,62 14.2,61.2 14.2,55.9 15.55,54.55 17.85,54.55 18.65,53.75 U$1.20
N$12
  Top 0.305: U$1.7 19.25,47.25 18.65,46.65 13.85,46.65 11.7,44.5 11.7,33.8 13,32.5 20.1,32.5 20.85,33.25 C13.2
N$13
  Top 0.305: U$1.5 19.35,46.25 19.05,45.95 14.05,45.95 12.7,44.6 12.7,37.3 14.1,35.9 15.05,35.9 C14.2
N$14
  Top 0.305: U$1.3 15.15,45.25 13.7,43.8 13.7,38.9 14.6,38 C17.2
N$15
  Top 0.305: U$1.1 15.65,44.25 15.1,43.7 15.1,40.05 C18.2
N$16
  Top 0.508: D2.A D3.C 27.15,48.7 C26.2
N$17
  Top 0.508: D1.A 30.15,45.7 C26.1 28.85,48.25 28.4,48.7 28.4,54.7 30.2,56.5 30.2,57.8 28.9,59.1 Q1.3 27.3,59.1 L3.P$1
N$18
  Bottom 0.61: JP9.2 48.87,82.35 J3.2
N$19
  Bottom 0.61: JP10.2 17.13,4.65 J4.2
N$20
  Bottom 0.61: JP11.2 31.13,4.65 J5.2
N$21
  Bottom 0.61: JP12.2 45.13,4.65 J6.2
N$22  (via drill 0.35)
  Top 0.508: v71.2,70.5 69.75,70.5 69.15,69.9 R22.2
  Bottom 0.508: JP13.2 71.29,68.8 71.29,70.5 v71.2,70.5
N$29
  Top 0.508: LED2.A R21.1
N$31
  Top 0.305: U$1.21 18.95,54.25 18.05,55.15 16.05,55.15 15.6,55.6 15.6,59.8 15.8,60 C27.2
N$32  (via drill 0.35)
  Top 0.305: U$1.6 21.35,46.75 v21.6,47
  Top 0.508: C28.2 v22.4,36
  Bottom 0.508: v22.4,36 20.6,37.8 20.6,46 v21.6,47
N$33
  Top 0.508: R22.1 LED1.A
RESE  (via drill 0.35)
  Top 0.305: U$1.22 19.25,54.75 18.8,55.2 18.8,56.5 v19.6,57.3
  Top 0.508: R1.1 21.5,62 22,61.5 22,59.1 v22.45,58.65 23.1,58 27.95,58 Q1.2
  Bottom 0.508: v19.6,57.3 20.95,58.65 v22.45,58.65
RST  (via drill 0.35)
  Top 0.406: IC3.45 82.95,40.65 v82.7,40.4 | v81.2,78 74.2,78 | 74.2,78 S2.3 | 74.2,78 74.2,76.05 R25.1
  Bottom 0.406: v81.2,78 81.2,41.9 v82.7,40.4
RX
  Top 0.406: IC3.40 78.7,40.2 80.28,38.62 J7.4
SCL  (via drill 0.35)
  Top 0.406: IC3.29 81.9,44.9 v82.3,44.5
  Bottom 0.508: v82.3,44.5 82.7,44.5 83.5,45.3 83.5,59.9 84.98,61.38 J9.4
SDA  (via drill 0.35)
  Top 0.406: v82.2,46 81.95,45.75 IC3.28
  Bottom 0.508: J9.3 84.02,63.92 82.2,62.1 v82.2,46
SPI_BUSY  (via drill 0.35)
  Top 0.305: U$1.16 19.25,51.75 18.1,52.9 v17.6,52.9
  Top 0.406: IC3.18 58.25,54.25 56.4,52.4 v54.1,52.4
  Bottom 0.508: v54.1,52.4 18.1,52.4 v17.6,52.9
SPI_CLK  (via drill 0.35)
  Top 0.305: U$1.12 18.95,49.75 18.3,49.1 16.4,49.1 v16.1,48.8
  Top 0.406: IC3.16 62.05,55.95 v61.7,56.3 | v61.8,50.3 54.2,50.3 v54.1,50.4
  Bottom 0.406: v61.7,56.3 61.8,56.2 v61.8,50.3
  Bottom 0.508: v16.1,48.8 17.7,50.4 v54.1,50.4
SPI_CS  (via drill 0.35)
  Top 0.305: U$1.13 18.45,50.25 18,49.8 v15,49.8
  Top 0.406: v55.1,51.4 59.7,51.4 60.2,51.9 v63.9,51.9 | v64.1,59.1 71.2,59.1 71.9,58.4 IC3.14
  Bottom 0.406: v63.9,51.9 63.9,58.9 v64.1,59.1
  Bottom 0.508: v15,49.8 16.6,51.4 v55.1,51.4
SPI_MISO  (via drill 0.35)
  Top 0.305: U$1.14 18.45,50.75 17.9,51.3 v15,51.3 | 54.8,55.1 v54.1,54.4
  Top 0.406: IC3.17 54.8,55.1
  Bottom 0.508: v15,51.3 15,54 16.3,55.3 32.5,55.3 33.4,54.4 v54.1,54.4
SPI_MOSI  (via drill 0.35)
  Top 0.305: U$1.11 19.35,49.25 18.3,48.2 v17.6,48.2
  Top 0.406: IC3.15 71.05,57.85 70.6,58.3 63.3,58.3 v62.9,57.9 | v62.8,49.2 55.3,49.2 v55.1,49.4
  Bottom 0.406: v62.9,57.9 62.9,49.3 v62.8,49.2
  Bottom 0.508: v17.6,48.2 18.8,49.4 v55.1,49.4
SPI_RST  (via drill 0.35)
  Top 0.305: U$1.15 18.75,51.25 18,52 16.4,52 v16.1,52.3 | 58.9,53.4 v58.8,53.3
  Top 0.406: IC3.19 58.9,53.4
  Bottom 0.305: 55.2,53.3 v55.1,53.4
  Bottom 0.406: v58.8,53.3 55.2,53.3
  Bottom 0.508: v16.1,52.3 16.1,53.4 16.7,54 31.7,54 32.3,53.4 v55.1,53.4
TX
  Top 0.406: IC3.39 77.85,37.25 79.02,36.08 J7.3
VG1  (via drill 0.35)
  Top 0.61: C1.1 R2.2 R3.1 14.5,74.35 14.5,82.1 | J1.1 14.5,82.1 | 14.5,82.1 13.6,83 v10.3,83
  Bottom 0.61: JP1.1 v10.3,83
VG2  (via drill 0.35)  (1 unrouted)
  Top 0.61: 29.85,73 R6.1 | R6.1 C2.1 | J2.1 28.8,82.4 | R6.1 28.8,74.05 28.8,82.4 | v24.1,83 26.6,83 28.2,83 28.8,82.4
  Bottom 0.61: JP2.1 v24.1,83
VG3  (via drill 0.35)  (1 unrouted)
  Top 0.61: 43.85,73 R9.1 | R9.1 C3.1 | J3.1 42.7,82.3 | R9.1 42.7,74.15 42.7,82.3 | v38.1,83 42,83 42.7,82.3
  Bottom 0.61: JP3.1 v38.1,83
VG4  (via drill 0.35)  (1 unrouted)
  Top 0.61: 22.25,13.9 R12.1 C4.1 v16,7.5 17.3,7.5 21.25,3.55 J4.1
  Bottom 0.61: v16,7.5 13.5,5 JP4.1 | 21.3,3.4 21.3,2.7 J4.1
VG5  (via drill 0.35)
  Top 0.61: C5.1 R14.2 R15.1 30.09,14.06 v30.09,7.19 31.41,7.19 35.25,3.35 J5.1
  Bottom 0.61: JP5.1 27.9,5 v30.09,7.19
VG6  (via drill 0.35)  (1 unrouted)
  Top 0.61: C6.1 R18.1 v44,7.6 44.9,7.6 49.25,3.25 J6.1
  Bottom 0.61: JP6.1 41.4,5 v44,7.6 | 49.4,3.2 49.4,2.8 J6.1
VGH  (via drill 0.35)
  Top 0.305: U$1.4 21.75,45.75 v21.9,45.6
  Top 0.508: v23.5,43.1 D1.C | v23.5,38.1 23.4,38 C19.1
  Bottom 0.508: v23.5,38.1 v23.5,43.1 23.5,44 v21.9,45.6
VGL
  Top 0.305: U$1.2 26.85,44.75 27.7,43.9 27.7,40
  Top 0.508: C25.1 27.7,40 30.4,40 31.9,41.5 31.9,48.25 D3.A

### Text on the board
tPlace: V2R2
tNames: JLCJLCJLCJLC